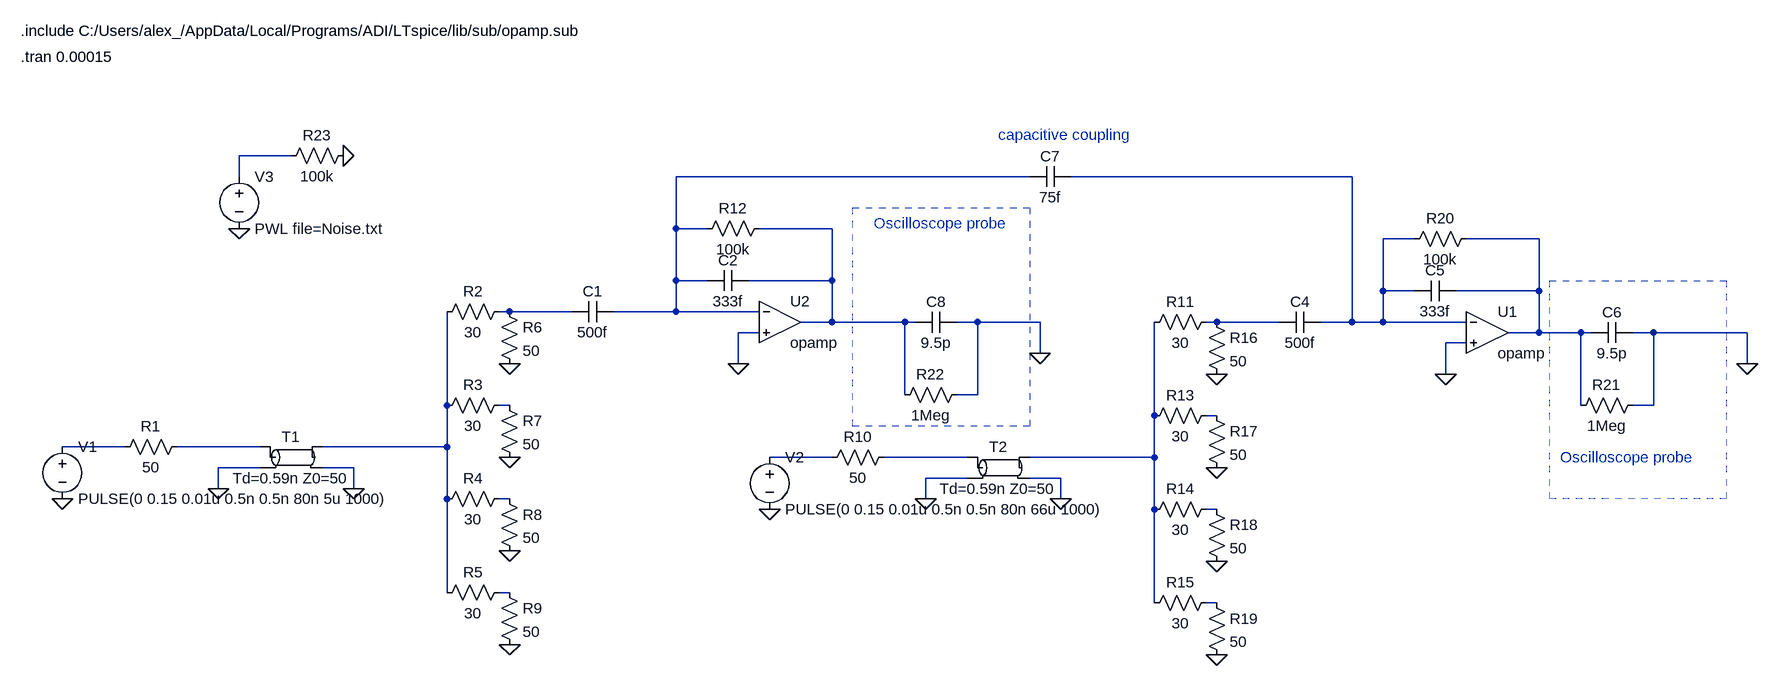
[diagram p0: schematic PassiveFilter_vs_CKBuffer.asc]
PassiveFilter_vs_CKBuffer.asc, the LTspice schematic file:
Version 4
SHEET 1 2628 680
WIRE 368 -304 288 -304
WIRE 288 -272 288 -304
WIRE 1504 -272 960 -272
WIRE 2000 -272 1568 -272
WIRE 960 -192 960 -272
WIRE 1008 -192 960 -192
WIRE 1200 -192 1088 -192
WIRE 2096 -176 2048 -176
WIRE 2288 -176 2176 -176
WIRE 960 -112 960 -192
WIRE 1008 -112 960 -112
WIRE 1200 -112 1200 -192
WIRE 1200 -112 1072 -112
WIRE 2048 -96 2048 -176
WIRE 2096 -96 2048 -96
WIRE 2288 -96 2288 -176
WIRE 2288 -96 2160 -96
WIRE 704 -64 688 -64
WIRE 800 -64 704 -64
WIRE 960 -64 960 -112
WIRE 960 -64 864 -64
WIRE 1088 -64 960 -64
WIRE 1200 -48 1200 -112
WIRE 1200 -48 1152 -48
WIRE 1312 -48 1200 -48
WIRE 1328 -48 1312 -48
WIRE 1424 -48 1392 -48
WIRE 1520 -48 1424 -48
WIRE 1792 -48 1776 -48
WIRE 1888 -48 1792 -48
WIRE 2000 -48 2000 -272
WIRE 2000 -48 1952 -48
WIRE 2048 -48 2048 -96
WIRE 2048 -48 2000 -48
WIRE 2176 -48 2048 -48
WIRE 1088 -32 1056 -32
WIRE 2288 -32 2288 -96
WIRE 2288 -32 2240 -32
WIRE 2352 -32 2288 -32
WIRE 2368 -32 2352 -32
WIRE 2464 -32 2432 -32
WIRE 2608 -32 2464 -32
WIRE 2176 -16 2144 -16
WIRE 1520 0 1520 -48
WIRE 1056 16 1056 -32
WIRE 2608 16 2608 -32
WIRE 2144 32 2144 -16
WIRE 1312 64 1312 -48
WIRE 1424 64 1424 -48
WIRE 1424 64 1392 64
WIRE 608 80 608 -64
WIRE 704 80 688 80
WIRE 2352 80 2352 -32
WIRE 2464 80 2464 -32
WIRE 2464 80 2432 80
WIRE 1696 96 1696 -48
WIRE 1792 96 1776 96
WIRE 112 144 16 144
WIRE 320 144 192 144
WIRE 608 144 608 80
WIRE 608 144 416 144
WIRE 1200 160 1104 160
WIRE 1408 160 1280 160
WIRE 1696 160 1696 96
WIRE 1696 160 1504 160
WIRE 320 176 256 176
WIRE 464 176 416 176
WIRE 1408 192 1344 192
WIRE 1552 192 1504 192
WIRE 256 208 256 176
WIRE 464 208 464 176
WIRE 608 224 608 144
WIRE 704 224 688 224
WIRE 1344 224 1344 192
WIRE 1552 224 1552 192
WIRE 1696 240 1696 160
WIRE 1792 240 1776 240
WIRE 608 368 608 224
WIRE 704 368 688 368
WIRE 1696 384 1696 240
WIRE 1792 384 1776 384
FLAG 704 448 0
FLAG 704 304 0
FLAG 704 160 0
FLAG 704 16 0
FLAG 464 208 0
FLAG 256 208 0
FLAG 16 224 0
FLAG 1520 0 0
FLAG 1056 16 0
FLAG 1792 464 0
FLAG 1792 320 0
FLAG 1792 176 0
FLAG 1792 32 0
FLAG 1552 224 0
FLAG 1344 224 0
FLAG 1104 240 0
FLAG 2608 16 0
FLAG 2144 32 0
FLAG 288 -192 0
FLAG 448 -304 0
SYMBOL res 208 128 R90
WINDOW 0 0 56 VBottom 2
WINDOW 3 32 56 VTop 2
SYMATTR InstName R1
SYMATTR Value 50
SYMBOL tline 368 160 R0
SYMATTR InstName T1
SYMATTR Value Td=0.59n Z0=50
SYMBOL res 704 -80 R90
WINDOW 0 0 56 VBottom 2
WINDOW 3 32 56 VTop 2
SYMATTR InstName R2
SYMATTR Value 30
SYMBOL res 704 64 R90
WINDOW 0 0 56 VBottom 2
WINDOW 3 32 56 VTop 2
SYMATTR InstName R3
SYMATTR Value 30
SYMBOL res 704 208 R90
WINDOW 0 0 56 VBottom 2
WINDOW 3 32 56 VTop 2
SYMATTR InstName R4
SYMATTR Value 30
SYMBOL res 704 352 R90
WINDOW 0 0 56 VBottom 2
WINDOW 3 32 56 VTop 2
SYMATTR InstName R5
SYMATTR Value 30
SYMBOL res 688 -80 R0
SYMATTR InstName R6
SYMATTR Value 50
SYMBOL res 688 64 R0
SYMATTR InstName R7
SYMATTR Value 50
SYMBOL res 688 208 R0
SYMATTR InstName R8
SYMATTR Value 50
SYMBOL res 688 352 R0
SYMATTR InstName R9
SYMATTR Value 50
SYMBOL cap 864 -80 R90
WINDOW 0 0 32 VBottom 2
WINDOW 3 32 32 VTop 2
SYMATTR InstName C1
SYMATTR Value 500f
SYMBOL voltage 16 128 R0
WINDOW 123 0 0 Left 0
WINDOW 39 0 0 Left 0
SYMATTR InstName V1
SYMATTR Value PULSE(0 0.15 0.01u 0.5n 0.5n 80n 5u 1000)
SYMBOL res 1104 -208 R90
WINDOW 0 0 56 VBottom 2
WINDOW 3 32 56 VTop 2
SYMATTR InstName R12
SYMATTR Value 100k
SYMBOL cap 1072 -128 R90
WINDOW 0 0 32 VBottom 2
WINDOW 3 32 32 VTop 2
SYMATTR InstName C2
SYMATTR Value 333f
SYMBOL OpAmps\\opamp 1120 -112 R0
SYMATTR InstName U2
SYMBOL res 1296 144 R90
WINDOW 0 0 56 VBottom 2
WINDOW 3 32 56 VTop 2
SYMATTR InstName R10
SYMATTR Value 50
SYMBOL tline 1456 176 R0
SYMATTR InstName T2
SYMATTR Value Td=0.59n Z0=50
SYMBOL res 1792 -64 R90
WINDOW 0 0 56 VBottom 2
WINDOW 3 32 56 VTop 2
SYMATTR InstName R11
SYMATTR Value 30
SYMBOL res 1792 80 R90
WINDOW 0 0 56 VBottom 2
WINDOW 3 32 56 VTop 2
SYMATTR InstName R13
SYMATTR Value 30
SYMBOL res 1792 224 R90
WINDOW 0 0 56 VBottom 2
WINDOW 3 32 56 VTop 2
SYMATTR InstName R14
SYMATTR Value 30
SYMBOL res 1792 368 R90
WINDOW 0 0 56 VBottom 2
WINDOW 3 32 56 VTop 2
SYMATTR InstName R15
SYMATTR Value 30
SYMBOL res 1776 -64 R0
SYMATTR InstName R16
SYMATTR Value 50
SYMBOL res 1776 80 R0
SYMATTR InstName R17
SYMATTR Value 50
SYMBOL res 1776 224 R0
SYMATTR InstName R18
SYMATTR Value 50
SYMBOL res 1776 368 R0
SYMATTR InstName R19
SYMATTR Value 50
SYMBOL cap 1952 -64 R90
WINDOW 0 0 32 VBottom 2
WINDOW 3 32 32 VTop 2
SYMATTR InstName C4
SYMATTR Value 500f
SYMBOL voltage 1104 144 R0
WINDOW 123 0 0 Left 0
WINDOW 39 0 0 Left 0
SYMATTR InstName V2
SYMATTR Value PULSE(0 0.15 0.01u 0.5n 0.5n 80n 66u 1000)
SYMBOL res 2192 -192 R90
WINDOW 0 0 56 VBottom 2
WINDOW 3 32 56 VTop 2
SYMATTR InstName R20
SYMATTR Value 100k
SYMBOL cap 2160 -112 R90
WINDOW 0 0 32 VBottom 2
WINDOW 3 32 32 VTop 2
SYMATTR InstName C5
SYMATTR Value 333f
SYMBOL OpAmps\\opamp 2208 -96 R0
SYMATTR InstName U1
SYMBOL cap 2432 -48 R90
WINDOW 0 0 32 VBottom 2
WINDOW 3 32 32 VTop 2
SYMATTR InstName C6
SYMATTR Value 9.5p
SYMBOL cap 1568 -288 R90
WINDOW 0 0 32 VBottom 2
WINDOW 3 32 32 VTop 2
SYMATTR InstName C7
SYMATTR Value 75f
SYMBOL res 2448 64 R90
WINDOW 0 0 56 VBottom 2
WINDOW 3 32 56 VTop 2
SYMATTR InstName R21
SYMATTR Value 1Meg
SYMBOL cap 1392 -64 R90
WINDOW 0 0 32 VBottom 2
WINDOW 3 32 32 VTop 2
SYMATTR InstName C8
SYMATTR Value 9.5p
SYMBOL res 1408 48 R90
WINDOW 0 0 56 VBottom 2
WINDOW 3 32 56 VTop 2
SYMATTR InstName R22
SYMATTR Value 1Meg
SYMBOL voltage 288 -288 R0
WINDOW 123 0 0 Left 0
WINDOW 39 0 0 Left 0
SYMATTR InstName V3
SYMATTR Value PWL file=Noise.txt
SYMBOL res 464 -320 R90
WINDOW 0 0 56 VBottom 2
WINDOW 3 32 56 VTop 2
SYMATTR InstName R23
SYMATTR Value 100k
TEXT -48 -456 Left 2 !.tran 0.00015
TEXT -48 -496 Left 2 !.include C:/Users/alex_/AppData/Local/Programs/ADI/LTspice/lib/sub/opamp.sub
TEXT 2320 160 Left 2 ;Oscilloscope probe
TEXT 1264 -200 Left 2 ;Oscilloscope probe
TEXT 1456 -336 Left 2 ;capacitive coupling
RECTANGLE Normal 1504 112 1232 -224 2
RECTANGLE Normal 2576 224 2304 -112 2

The netlist it stands for:
* PassiveFilter_vs_CKBuffer.asc
R1 N013 N012 50
T1 N013 0 N008 0 Td=0.59n Z0=50
R2 N006 N008 30
R3 N009 N008 30
R4 N016 N008 30
R5 N018 N008 30
R6 N006 0 50
R7 N009 0 50
R8 N016 0 50
R9 N018 0 50
C1 N002 N006 500f
V1 N012 0 PULSE(0 0.15 0.01u 0.5n 0.5n 80n 5u 1000)
R12 N004 N002 100k
C2 N004 N002 333f
XU2 N002 0 N004 opamp Aol=100K GBW=10Meg  ; pins invin noninvin out
R10 N015 N014 50
T2 N015 0 N010 0 Td=0.59n Z0=50
R11 N007 N010 30
R13 N011 N010 30
R14 N017 N010 30
R15 N019 N010 30
R16 N007 0 50
R17 N011 0 50
R18 N017 0 50
R19 N019 0 50
C4 N003 N007 500f
V2 N014 0 PULSE(0 0.15 0.01u 0.5n 0.5n 80n 66u 1000)
R20 N005 N003 100k
C5 N005 N003 333f
XU1 N003 0 N005 opamp Aol=100K GBW=10Meg  ; pins invin noninvin out
C6 0 N005 9.5p
C7 N003 N002 75f
R21 0 N005 1Meg
C8 0 N004 9.5p
R22 0 N004 1Meg
V3 N001 0 PWL file=Noise.txt
R23 0 N001 100k
.tran 0.00015
.include C:/Users/alex_/AppData/Local/Programs/ADI/LTspice/lib/sub/opamp.sub
* Oscilloscope probe
* Oscilloscope probe
* capacitive coupling
.backanno
.end